# Altium schematic sheet MPU6000.SchDoc
size A4
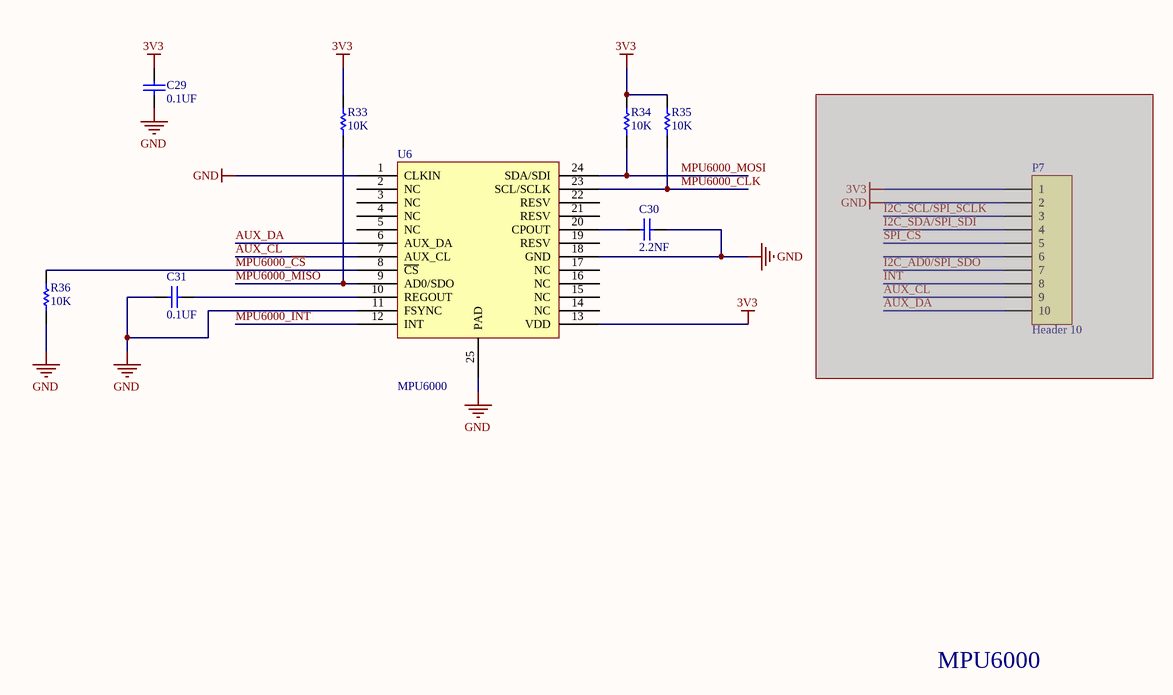
[diagram p0: MPU6000.SchDoc]

## Parts
C29  value 0.1UF  [RC0805]  (hidden comment: Cap)
C30  value 2.2NF  [RC0805]  (hidden comment: Cap)
C31  value 0.1UF  [RC0805]  (hidden comment: Cap)
P7  Header 10  [HDR1X10]  (masked out: inside a compile mask, not in the netlist)
R33  value 10K  [RC0805]  (hidden comment: Res1)
R34  value 10K  [RC0805]  (hidden comment: Res1)
R35  value 10K  [RC0805]  (hidden comment: Res1)
R36  value 10K  [RC0805]  (hidden comment: Res1)
U6  MPU6000  [QFN24_M]

## Nets
3V3: C29.2 R33.1 R34.1 R35.1 U6.13(VDD)
GND: C29.1 C30.2 C31.1 R36.2 U6.1(CLKIN) U6.11(FSYNC) U6.18(GND) U6.25(PAD)
AUX_CL: U6.7(AUX_CL)
AUX_DA: U6.6(AUX_DA)
MPU6000_~{CS}: R36.1 U6.8(~{CS})
MPU6000_CLK: R35.2 U6.23(SCL/SCLK)
MPU6000_INT: U6.12(INT)
MPU6000_MISO: R33.2 U6.9(AD0/SDO)
MPU6000_MOSI: R34.2 U6.24(SDA/SDI)
NetC30_1: C30.1 U6.20(CPOUT)
NetC31_2: C31.2 U6.10(REGOUT)

Not connected (* = marked no-connect by the designer): U6 2(NC) 3(NC) 4(NC) 5(NC) 14(NC) 15(NC) 16(NC) 17(NC) 19(RESV) 21(RESV) 22(RESV)

## Notes on the sheet
- MPU6000

## Library data of the parts
C29-C31 = Cap: Capacitor; Published: 8-Jun-2000; LatestRevisionDate: 17-Jul-2002; LatestRevisionNote: Re-released for DXP Platform.; PackageReference: RAD-0.3; Publisher: Altium Limited; PackageDescription: Radial Cap, Thru-Hole; 2 Leads; 0.3 in Pin Spacing
P7 = Header 10: Header, 10-Pin; LatestRevisionDate: 17-Jul-2002; LatestRevisionNote: Re-released for DXP Platform.; Publisher: Altium Limited
R33-R36 = Res1: Resistor; Published: 8-Jun-2000; LatestRevisionDate: 17-Jul-2002; LatestRevisionNote: Re-released for DXP Platform.; PackageReference: AXIAL-0.3; Publisher: Altium Limited; PackageDescription: Axial Device, Thru-Hole; 2 Leads; 0.3 in Pin Spacing